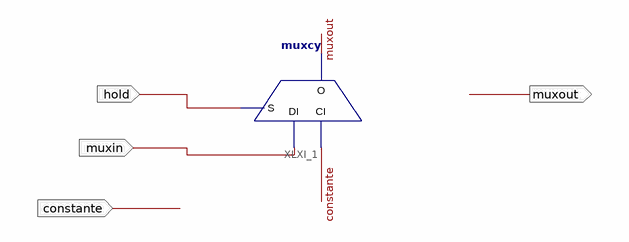
[diagram p0: schematic sheet 1]
// Xilinx ISE schematic mux1.sch (artix7) as structural Verilog: 1 symbols, 4 ports
module mux1 (
  input  hold,
  input  muxin,
  input  constante,
  output muxout
);

  muxcy XLXI_1 (.CI(constante), .DI(muxin), .S(hold), .O(muxout));
endmodule
